# Altium schematic sheet peripheral.SchDoc
size A4; SheetNumber: 2; SheetTotal: 3
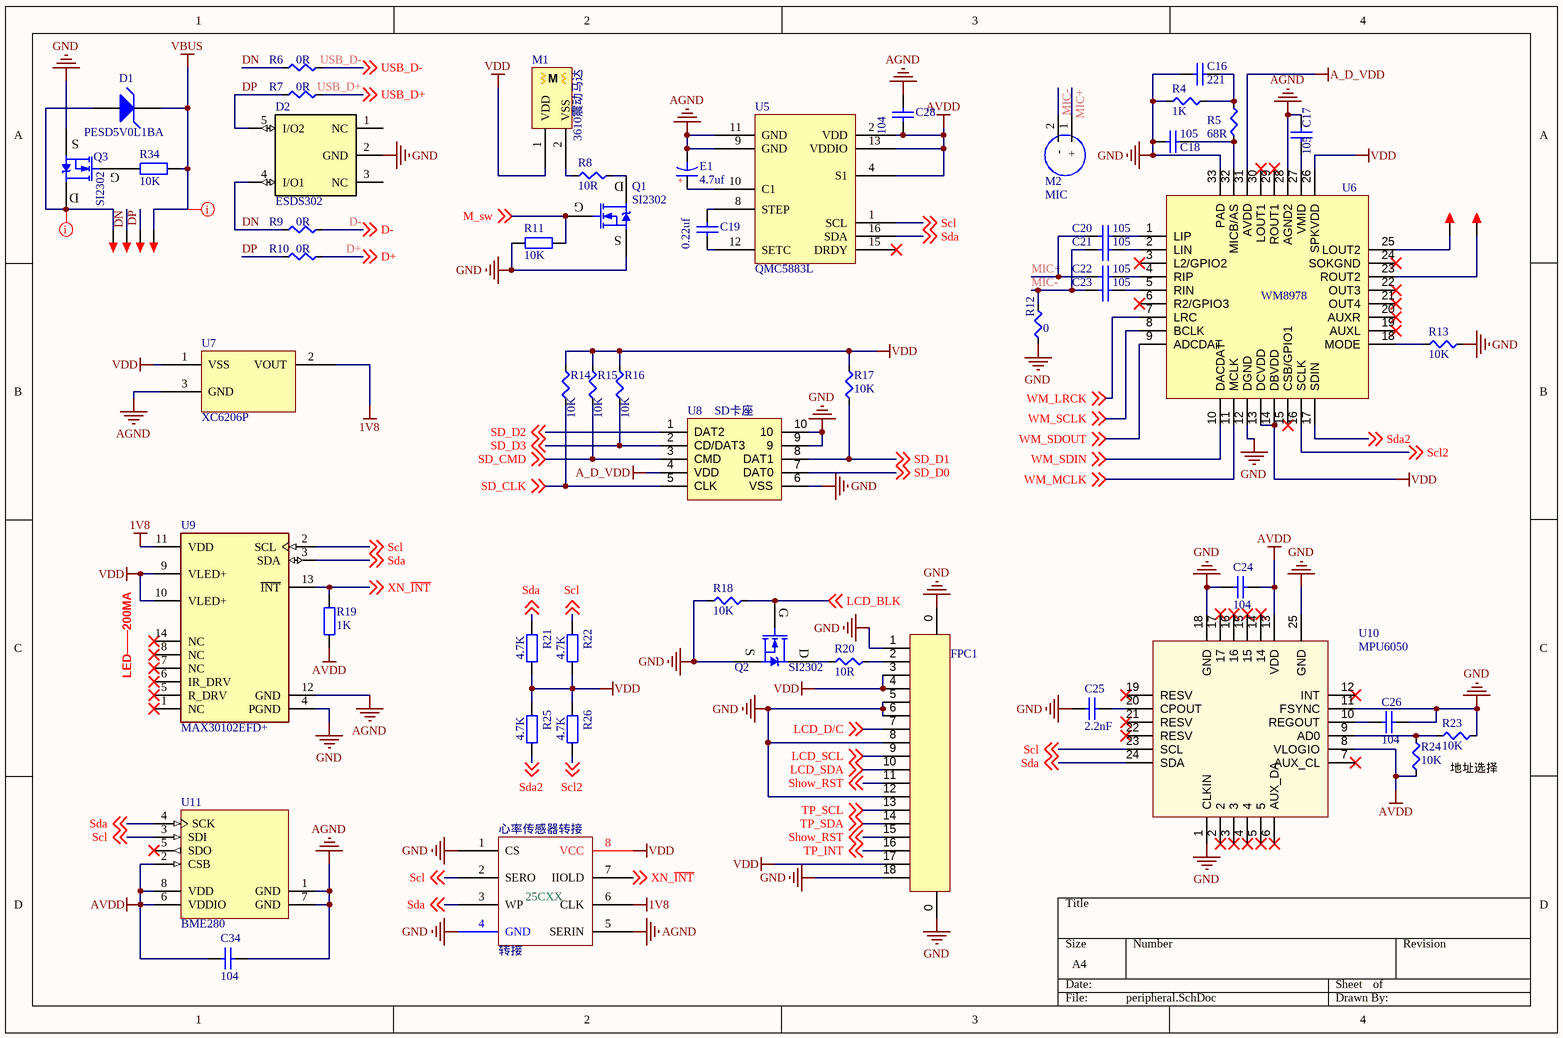
[diagram p0: peripheral.SchDoc]

## Parts
C16  221  [C 0603_L]
C17  105  [C 0603_L]
C18  105  [C 0603_L]
C19  0.22uf  [C 0603_L]
C20  105  [C 0603_L]
C21  105  [C 0603_L]
C22  105  [C 0603_L]
C23  105  [C 0603_L]
C24  104  [C 0603_L]
C25  2.2nF  [C 0603_L]
C26  104  [C 0603_L]
C28  104  [C 0603_L]
C34  104  [C 0603_L]
D1  PESD5V0L1BA  [SOD-323]
D2  ESDS302  [SOT23-5]
E1  4.7uf  [CD A(3216)]
FPC1  FPC  [FPC0.5 2H-WS-18P]  (value not drawn)
M1  3610震动马达
M2  MIC  [驻极体电容咪头（ECM）]
Q1  SI2302  [SOT23-3N]
Q2  SI2302  [SOT23-3N]
Q3  SI2302  [SOT23-3N]
R4  1K  [R 0603_L]
R5  68R  [R 0603_L]
R6  0R  [R 0603_L]
R7  0R  [R 0603_L]
R8  10R  [R 0603_L]
R9  0R  [R 0603_L]
R10  0R  [R 0603_L]
R11  10K  [R 0603_L]
R12  0  [R 0603_L]
R13  10K  [R 0603_L]
R14  10K  [R 0603_L]
R15  10K  [R 0603_L]
R16  10K  [R 0603_L]
R17  10K  [R 0603_L]
R18  10K  [R 0603_L]
R19  1K  [R 0603_L]
R20  10R  [R 0603_L]
R21  4.7K  [R 0603_L]
R22  4.7K  [R 0603_L]
R23  10K  [R 0603_L]
R24  10K  [R 0603_L]
R25  4.7K  [R 0603_L]
R26  4.7K  [R 0603_L]
R34  10K  [R 0603_L]
TP3  TEST  [TEST 1]  (value not drawn)
TP4  TEST  [TEST 1]  (value not drawn)
TP5  TEST  [TEST 1]  (value not drawn)
TP6  TEST  [TEST 1]  (value not drawn)
TP7  TEST  [TEST 1]  (value not drawn)
TP8  TEST  [TEST 1]  (value not drawn)
U5  QMC5883L  [LGA-16_L3.0-W3.0-P0.50-BL_SQ]
U6  WM8978  [QFN32-P50]
U7  XC6206P  [SOT23]
U8  SD卡座  [SD卡座]
U9  MAX30102EFD+  [FP-F143A5-1-MFG]
U10  MPU6050  [QFN24 4x4_N]
U11  BME280  [BOSC-BME280-8_V]
心率传感器转接  转接  [SOP8改]

## Nets
1V8: U7.2(VOUT) U9.11(VDD) 心率传感器转接.6(CLK)
A_D_VDD: U6.31(AVDD) U8.4(VDD)
AGND: C17.2 C28.2 C34.1 E1.2(K) U5.9(GND) U5.11(GND) U6.28(AGND2) U7.3(GND) U9.12(GND) U11.1(GND) U11.7(GND) 心率传感器转接.5(SERIN)
AVDD: C24.1 C28.1 C34.2 R19.1 R24.1 U5.2(VDD) U5.4(S1) U5.13(VDDIO) U10.8(VLOGIO) U10.13(VDD) U11.2(CSB) U11.6(VDDIO) U11.8(VDD)
GND: C16.1 C18.1 C24.2 C25.2 C26.1 D2.2(GND) FPC1.0 FPC1.1 FPC1.5 FPC1.6 FPC1.8 FPC1.12 FPC1.18 Q1.2(S) Q2.2(S) Q3.2(S) R4.1 R11.1 R12.1 R13.2 R18.1 R23.2 U6.12(DGND) U6.33(PAD) U8.6(VSS) U8.9 U8.10 U9.4(PGND) U10.1(CLKIN) U10.11(FSYNC) U10.18(GND) U10.25(GND) 心率传感器转接.1(CS) 心率传感器转接.4(GND)
VBUS: D1.2(K) R34.2 TP8.1
VDD: FPC1.3 FPC1.4 FPC1.17 M1.1(VDD) R14.2 R15.2 R16.2 R17.2 R21.2 R22.2 R25.1 R26.1 U6.13(DCVDD) U6.14(DBVDD) U6.26(SPKVDD) U7.1(VSS) U9.9(VLED+) U9.10(VLED+) 心率传感器转接.8(VCC)
D+: R10.2 ; off-sheet D+
D-: R9.2 ; off-sheet D-
DN: D2.4(I/O1) R6.1 R9.1 TP7.1
DP: D2.5(I/O2) R7.1 R10.1 TP4.1
LCD_BLK: Q2.1(G) R18.2 ; off-sheet LCD_BLK
LCD_D/C: FPC1.7 ; off-sheet LCD_D/C
LCD_SCL: FPC1.9 ; off-sheet LCD_SCL
LCD_SDA: FPC1.10 ; off-sheet LCD_SDA
M_sw: Q1.1(G) R11.2 ; off-sheet M_sw
MIC+: C20.1 C22.1 M2.1(+)
MIC-: C21.1 C23.1 M2.2(-) R12.2
Scl: R22.1 U5.1(SCL) U9.2(SCL) U10.23(SCL) U11.3(SDI) 心率传感器转接.2(SERO) ; off-sheet Scl
Scl2: R26.2 U6.16(SCLK) ; off-sheet Scl2
SD_CLK: R14.1 U8.5(CLK) ; off-sheet SD_CLK
SD_CMD: R15.1 U8.3(CMD) ; off-sheet SD_CMD
SD_D0: U8.7(DAT0) ; off-sheet SD_D0
SD_D1: R17.1 U8.8(DAT1) ; off-sheet SD_D1
SD_D2: U8.1(DAT2) ; off-sheet SD_D2
SD_D3: R16.1 U8.2(CD/DAT3) ; off-sheet SD_D3
Sda: R21.1 U5.16(SDA) U9.3(SDA) U10.24(SDA) U11.4(SCK) 心率传感器转接.3(WP) ; off-sheet Sda
Sda2: R25.2 U6.17(SDIN) ; off-sheet Sda2
Show_RST: FPC1.11 FPC1.15 ; off-sheet Show_RST
TP_INT: FPC1.16 ; off-sheet TP_INT
TP_SCL: FPC1.13 ; off-sheet TP_SCL
TP_SDA: FPC1.14 ; off-sheet TP_SDA
USB_D+: R7.2 ; off-sheet USB_D+
USB_D-: R6.2 ; off-sheet USB_D-
WM_LRCK: U6.7(LRC) ; off-sheet WM_LRCK
WM_MCLK: U6.11(MCLK) ; off-sheet WM_MCLK
WM_SCLK: U6.8(BCLK) ; off-sheet WM_SCLK
WM_SDIN: U6.10(DACDAT) ; off-sheet WM_SDIN
WM_SDOUT: U6.9(ADCDAT) ; off-sheet WM_SDOUT
XN_~{INT}: R19.2 U9.13(~{INT}) 心率传感器转接.7(IIOLD) ; off-sheet XN_~{INT}
NetC16_2: C16.2 R4.2 R5.2
NetC17_1: C17.1 U6.27(VMID)
NetC18_2: C18.2 R5.1 U6.32(MICB/AS)
NetC19_1: C19.1 U5.12(SETC)
NetC19_2: C19.2 U5.8(STEP)
NetC20_2: C20.2 U6.1(LIP)
NetC21_2: C21.2 U6.2(LIN)
NetC22_2: C22.2 U6.4(RIP)
NetC23_2: C23.2 U6.5(RIN)
NetC25_1: C25.1 U10.20(CPOUT)
NetC26_2: C26.2 U10.10(REGOUT)
NetD1_1: D1.1(A) Q3.3(D) TP3.1
NetE1_1: E1.1(A) U5.10(C1)
NetFPC1_2: FPC1.2 R20.2
NetM1_2: M1.2(VSS) R8.1
NetQ1_3: Q1.3(D) R8.2
NetQ2_3: Q2.3(D) R20.1
NetQ3_1: Q3.1(G) R34.1
NetR13_1: R13.1 U6.18(MODE)
NetR23_1: R23.1 R24.2 U10.9(AD0)
NetTP5_1: TP5.1 U6.25(LOUT2)
NetTP6_1: TP6.1 U6.23(ROUT2)

Not connected (* = marked no-connect by the designer): D2 1(NC) 3(NC); U5 15(DRDY)*; U6 3(L2/GPIO2)* 6(R2/GPIO3)* 15(CSB/GPIO1)* 19(AUXL)* 20(AUXR)* 21(OUT4)* 22(OUT3)* 24(SOKGND)* 29(ROUT1)* 30(LOUT1)*; U9 1(NC)* 5(R_DRV)* 6(IR_DRV)* 7(NC)* 8(NC)* 14(NC)*; U10 2* 3* 4* 5* 6(AUX_DA)* 7(AUX_CL)* 12(INT)* 14* 15* 16* 17* 19(RESV)* 21(RESV)* 22(RESV)*; U11 5(SDO)*

## Layout directives
net class Power: NetD1_1, VBUS

## Notes on the sheet
- (near U9) LED——200MA
- (near FPC1) GND
- (near FPC1) LEDK
- (near FPC1) VCC
- (near FPC1) LOVCC
- (near FPC1) D/C
- (near FPC1) CS
- (near FPC1) SCL
- (near FPC1) SDA
- (near FPC1) RESET
- 地址选择
- (near FPC1) TPSCL
- (near FPC1) TPSDA
- (near FPC1) TPRST
- (near FPC1) TPINT
- (near FPC1) VDD
- (in symbol CT) +
- (in symbol 贴片震动电机3610) M

## Library data of the parts
C16-C26 C28 C34 = C: 贴片电容; BOM名称: 无极性贴片电容; 联系卖家，免费查找封装: 唯一出售店铺网址https://shop463601444.taobao.com; 封装库来自淘宝卖家ID：黄晶宝石: 其他店铺购入均为盗版假冒封装库
D1 = PESD3V3L1BA: 3.3v ESD
D2 = ESD: USB2.0/Dual 2.3-pF, 3.6-V, ±30-kV
E1 = CT: 贴片钽电容; 联系卖家，免费查找封装: 唯一出售店铺网址https://shop463601444.taobao.com; 封装库来自淘宝卖家ID：黄晶宝石: 其他店铺购入均为盗版假冒封装库; BOM名称: 贴片钽电容
FPC1 = FPC18Pin: FPC 连接座,脚距0.5
M1 = 贴片震动电机3610
M2 = MIC: 驻极体电容咪头（ECM）φ4.5 x H2.2 mm
Q1-Q3 = SI2302: N沟道场效应管; 联系卖家，免费查找封装: 唯一出售店铺网址https://shop463601444.taobao.com; BOM名称: N沟道场效应管
R4-R26 R34 = R: 贴片电阻; 联系卖家，免费查找封装: 唯一出售店铺网址https://shop463601444.taobao.com; 封装库来自淘宝卖家ID：黄晶宝石: 其他店铺购入均为盗版假冒封装库; BOM名称: 贴片电阻
TP3-TP8 = TEST: 测试点; 联系卖家，免费查找封装: 唯一出售店铺网址https://shop463601444.taobao.com; BOM名称: 测试点
U5 = QMC5883L: 三轴磁传感器
U6 = WM9878: 音频编解码芯片
U7 = XC6206P: 最大输入电压：7V / 最大输出电流：200mA / 输入输出压差：200mV / 命名：（XC6205P）18代表1.8V
U8 = SD卡座: SD卡座 简易短体式带壳
U9 = CMP-05738-000003-1: IC SENSOR OXIMETER/HEARTRATE; Manufacturer: Maxim Integrated; Max Junction Temp: +90°C; Min Supply Voltage: 1.7V; Sensor Output: I2C; Operating Supply Current: 600uA; Max Supply Voltage: 2V; Package: F143A5-1; Manufacturer Part Number: MAX30102EFD+; Footprint Url: https://pdfserv.maximintegrated.com/land_patterns/90-0602.PDF; ComponentLink2URL: https://datasheets.maximintegrated.com/en/ds/MAX30102.pdf; Temperature: -40°C to +85°C; Device Class L2: unset; Mouser Description: Pulse Oximeter/Heart Rate Sensor, Oesip; Temperature Range High: +85°C; Automotive: No; Height: 1.65mm; Digikey Description: IC SENSOR OXIMETER/HEARTRATE; Category: IC; Lead Free: Yes; RoHS: TRUE; Temperature Range Low: -40°C; ComponentLink2Description: Datasheet; Octopart: https://octopart.com/max30102efd%2B-maxim+integrated-59568799; Device Class L3: unset; Device Class L1: Sensors
U10 = MPU6050: QFN24 4X4三轴加速度+三轴陀螺仪; 联系卖家，免费查找封装: 唯一出售店铺网址https://shop463601444.taobao.com
U11 = CMP-2000-05073-1: Combined Humidity and Pressure Sensor, 1.71 to 3.6 V, -40 to 85 degC, 8-Pin SMD, RoHS, Tape and Reel; Manufacturer: Bosch Sensortec; Datasheet Version: Rev. 1.2, 10/2015; Datasheet URL: http://datasheet.octopart.com/BME280-Bosch-datasheet-58577763.pdf; Manufacturer URL: http://www.bosch-sensortec.com
心率传感器转接 = 25CXX: 联系卖家，免费查找封装: 唯一出售店铺网址https://shop463601444.taobao.com